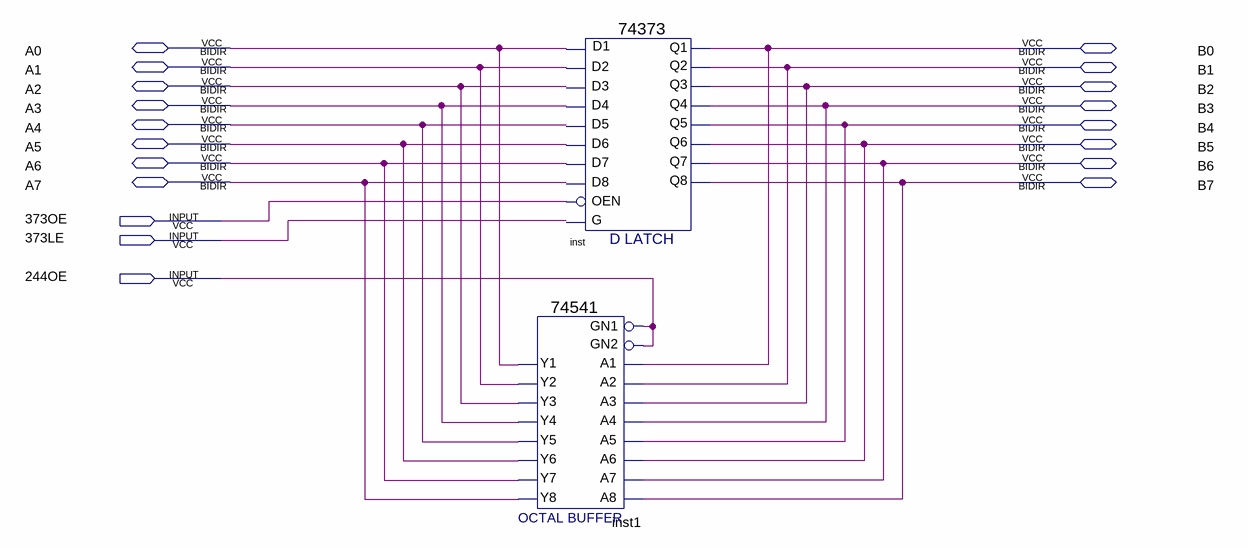
[diagram p0: schematic sheet]
// Quartus schematic TR_245.bdf as structural Verilog: 2 symbols, 19 pins
module TR_245 (
  input  \373OE ,
  input  \373LE ,
  input  \244OE ,
  inout  A0,
  inout  B0,
  inout  A1,
  inout  B1,
  inout  A2,
  inout  B2,
  inout  A3,
  inout  B3,
  inout  A4,
  inout  B4,
  inout  A5,
  inout  B5,
  inout  A6,
  inout  B6,
  inout  A7,
  inout  B7
);

  \74373  inst (
    .D1(A0), .D3(A2), .D6(A5), .D7(A6), .D2(A1), .G(\373LE ), .D4(A3), .D5(A4), .D8(A7), .OEN(\373OE ),
    .Q3(B2), .Q6(B5), .Q7(B6), .Q2(B1), .Q8(B7), .Q4(B3), .Q5(B4), .Q1(B0));
  \74541  inst1 (
    .GN2(\244OE ), .A1(B0), .A4(B3), .A3(B2), .A2(B1), .A7(B6), .A6(B5), .A5(B4), .GN1(\244OE ), .A8(B7),
    .Y8(A7), .Y5(A4), .Y6(A5), .Y7(A6), .Y2(A1), .Y3(A2), .Y4(A3), .Y1(A0));
endmodule
